# EAGLE design mt15_n (EAGLE 6.6.0)
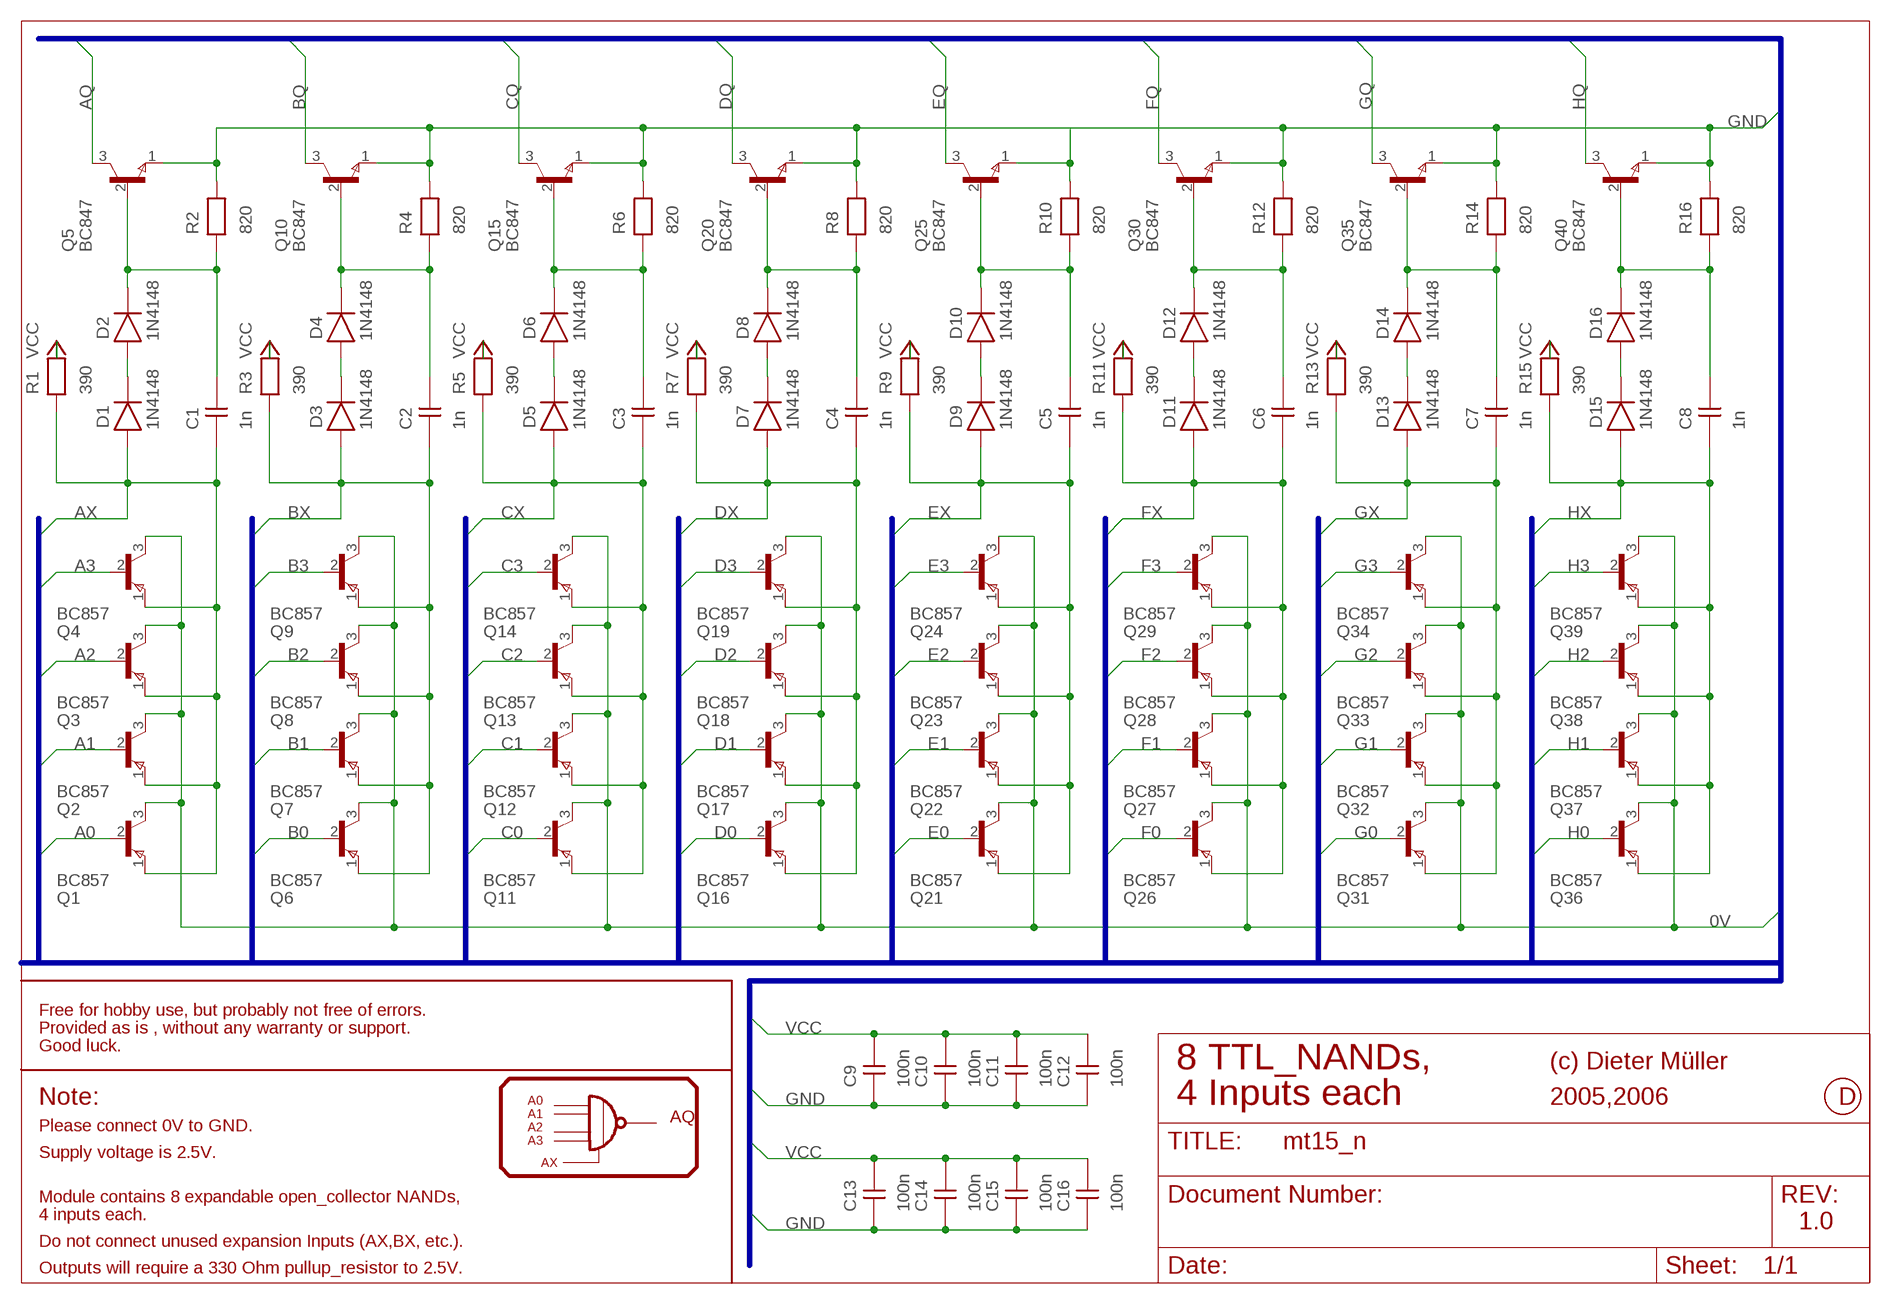
[diagram p0: schematic, sheet 1]

## Parts
C1  1n  CAPNP-5@2  [0204]
C2  1n  CAPNP-5@2  [0204]
C3  1n  CAPNP-5@2  [0204]
C4  1n  CAPNP-5@2  [0204]
C5  1n  CAPNP-5@2  [0204]
C6  1n  CAPNP-5@2  [0204]
C7  1n  CAPNP-5@2  [0204]
C8  1n  CAPNP-5@2  [0204]
C9  100n  CAPNP-5@2  [0204]
C10  100n  CAPNP-5@2  [0204]
C11  100n  CAPNP-5@2  [0204]
C12  100n  CAPNP-5@2  [0204]
C13  100n  CAPNP-5@2  [0204]
C14  100n  CAPNP-5@2  [0204]
C15  100n  CAPNP-5@2  [0204]
C16  100n  CAPNP-5@2  [0204]
D1  1N4148  DIODE-7,5@2  [0204D]
D2  1N4148  DIODE-7,5@2  [0204D]
D3  1N4148  DIODE-7,5@2  [0204D]
D4  1N4148  DIODE-7,5@2  [0204D]
D5  1N4148  DIODE-7,5@2  [0204D]
D6  1N4148  DIODE-7,5@2  [0204D]
D7  1N4148  DIODE-7,5@2  [0204D]
D8  1N4148  DIODE-7,5@2  [0204D]
D9  1N4148  DIODE-7,5@2  [0204D]
D10  1N4148  DIODE-7,5@2  [0204D]
D11  1N4148  DIODE-7,5@2  [0204D]
D12  1N4148  DIODE-7,5@2  [0204D]
D13  1N4148  DIODE-7,5@2  [0204D]
D14  1N4148  DIODE-7,5@2  [0204D]
D15  1N4148  DIODE-7,5@2  [0204D]
D16  1N4148  DIODE-7,5@2  [0204D]
Q1  BC857  BC557@2  [SOT-23]
Q2  BC857  BC557@2  [SOT-23]
Q3  BC857  BC557@2  [SOT-23]
Q4  BC857  BC557@2  [SOT-23]
Q5  BC847  BC547@2  [SOT-23]
Q6  BC857  BC557@2  [SOT-23]
Q7  BC857  BC557@2  [SOT-23]
Q8  BC857  BC557@2  [SOT-23]
Q9  BC857  BC557@2  [SOT-23]
Q10  BC847  BC547@2  [SOT-23]
Q11  BC857  BC557@2  [SOT-23]
Q12  BC857  BC557@2  [SOT-23]
Q13  BC857  BC557@2  [SOT-23]
Q14  BC857  BC557@2  [SOT-23]
Q15  BC847  BC547@2  [SOT-23]
Q16  BC857  BC557@2  [SOT-23]
Q17  BC857  BC557@2  [SOT-23]
Q18  BC857  BC557@2  [SOT-23]
Q19  BC857  BC557@2  [SOT-23]
Q20  BC847  BC547@2  [SOT-23]
Q21  BC857  BC557@2  [SOT-23]
Q22  BC857  BC557@2  [SOT-23]
Q23  BC857  BC557@2  [SOT-23]
Q24  BC857  BC557@2  [SOT-23]
Q25  BC847  BC547@2  [SOT-23]
Q26  BC857  BC557@2  [SOT-23]
Q27  BC857  BC557@2  [SOT-23]
Q28  BC857  BC557@2  [SOT-23]
Q29  BC857  BC557@2  [SOT-23]
Q30  BC847  BC547@2  [SOT-23]
Q31  BC857  BC557@2  [SOT-23]
Q32  BC857  BC557@2  [SOT-23]
Q33  BC857  BC557@2  [SOT-23]
Q34  BC857  BC557@2  [SOT-23]
Q35  BC847  BC547@2  [SOT-23]
Q36  BC857  BC557@2  [SOT-23]
Q37  BC857  BC557@2  [SOT-23]
Q38  BC857  BC557@2  [SOT-23]
Q39  BC857  BC557@2  [SOT-23]
Q40  BC847  BC547@2  [SOT-23]
R1  390  RESEU-7,5@2  [0204]
R2  820  RESEU-7,5@2  [0204]
R3  390  RESEU-7,5@2  [0204]
R4  820  RESEU-7,5@2  [0204]
R5  390  RESEU-7,5@2  [0204]
R6  820  RESEU-7,5@2  [0204]
R7  390  RESEU-7,5@2  [0204]
R8  820  RESEU-7,5@2  [0204]
R9  390  RESEU-7,5@2  [0204]
R10  820  RESEU-7,5@2  [0204]
R11  390  RESEU-7,5@2  [0204]
R12  820  RESEU-7,5@2  [0204]
R13  390  RESEU-7,5@2  [0204]
R14  820  RESEU-7,5@2  [0204]
R15  390  RESEU-7,5@2  [0204]
R16  820  RESEU-7,5@2  [0204]

## Nets
0V: Q1.3(C) Q2.3(C) Q3.3(C) Q4.3(C) Q6.3(C) Q7.3(C) Q8.3(C) Q9.3(C) Q11.3(C) Q12.3(C) Q13.3(C) Q14.3(C) Q16.3(C) Q17.3(C) Q18.3(C) Q19.3(C) Q21.3(C) Q22.3(C) Q23.3(C) Q24.3(C) Q26.3(C) Q27.3(C) Q28.3(C) Q29.3(C) Q31.3(C) Q32.3(C) Q33.3(C) Q34.3(C) Q36.3(C) Q37.3(C) Q38.3(C) Q39.3(C)
A0: Q1.2(B)
A1: Q2.2(B)
A2: Q3.2(B)
A3: Q4.2(B)
AQ: Q5.3(C)
AX: C1.1 D1.1(A) Q1.1(E) Q2.1(E) Q3.1(E) Q4.1(E) R1.1
B0: Q6.2(B)
B1: Q7.2(B)
B2: Q8.2(B)
B3: Q9.2(B)
BQ: Q10.3(C)
BX: C2.1 D3.1(A) Q6.1(E) Q7.1(E) Q8.1(E) Q9.1(E) R3.1
C0: Q11.2(B)
C1: Q12.2(B)
C2: Q13.2(B)
C3: Q14.2(B)
CQ: Q15.3(C)
CX: C3.1 D5.1(A) Q11.1(E) Q12.1(E) Q13.1(E) Q14.1(E) R5.1
D0: Q16.2(B)
D1: Q17.2(B)
D2: Q18.2(B)
D3: Q19.2(B)
DQ: Q20.3(C)
DX: C4.1 D7.1(A) Q16.1(E) Q17.1(E) Q18.1(E) Q19.1(E) R7.1
E0: Q21.2(B)
E1: Q22.2(B)
E2: Q23.2(B)
E3: Q24.2(B)
EQ: Q25.3(C)
EX: C5.1 D9.1(A) Q21.1(E) Q22.1(E) Q23.1(E) Q24.1(E) R9.1
F0: Q26.2(B)
F1: Q27.2(B)
F2: Q28.2(B)
F3: Q29.2(B)
FQ: Q30.3(C)
FX: C6.1 D11.1(A) Q26.1(E) Q27.1(E) Q28.1(E) Q29.1(E) R11.1
G0: Q31.2(B)
G1: Q32.2(B)
G2: Q33.2(B)
G3: Q34.2(B)
GND: C9.1 C10.1 C11.1 C12.1 C13.1 C14.1 C15.1 C16.1 Q5.1(E) Q10.1(E) Q15.1(E) Q20.1(E) Q25.1(E) Q30.1(E) Q35.1(E) Q40.1(E) R2.2 R4.2 R6.2 R8.2 R10.2 R12.2 R14.2 R16.2
GQ: Q35.3(C)
GX: C7.1 D13.1(A) Q31.1(E) Q32.1(E) Q33.1(E) Q34.1(E) R13.1
H0: Q36.2(B)
H1: Q37.2(B)
H2: Q38.2(B)
H3: Q39.2(B)
HQ: Q40.3(C)
HX: C8.1 D15.1(A) Q36.1(E) Q37.1(E) Q38.1(E) Q39.1(E) R15.1
N$2: D1.2(K) D2.1(A)
N$3: C1.2 D2.2(K) Q5.2(B) R2.1
N$6: D3.2(K) D4.1(A)
N$7: C2.2 D4.2(K) Q10.2(B) R4.1
N$11: D5.2(K) D6.1(A)
N$12: C3.2 D6.2(K) Q15.2(B) R6.1
N$16: D7.2(K) D8.1(A)
N$17: C4.2 D8.2(K) Q20.2(B) R8.1
N$21: D9.2(K) D10.1(A)
N$22: C5.2 D10.2(K) Q25.2(B) R10.1
N$26: D11.2(K) D12.1(A)
N$27: C6.2 D12.2(K) Q30.2(B) R12.1
N$31: D13.2(K) D14.1(A)
N$32: C7.2 D14.2(K) Q35.2(B) R14.1
N$36: D15.2(K) D16.1(A)
N$37: C8.2 D16.2(K) Q40.2(B) R16.1
VCC: C9.2 C10.2 C11.2 C12.2 C13.2 C14.2 C15.2 C16.2 R1.2 R3.2 R5.2 R7.2 R9.2 R11.2 R13.2 R15.2

## Buses
B$1

## Notes on the sheet
- Free for hobby use, but probably not free of errors.
- Provided as is , without any warranty or support.
- Good luck.
- 8 TTL_NANDs, | (c) Dieter Müller
- Note: | A0 | 4 Inputs each | 2005,2006 | D
- A1
- AQ
- Please connect 0V to GND. | A2
- A3
- Supply voltage is 2.5V.
- AX
- Module contains 8 expandable open_collector NANDs,
- 4 inputs each.
- 1.0
- Do not connect unused expansion Inputs (AX,BX, etc.).
- Zehn kleine Bastler fein, die löten Teile ein.
- Doch plötzlich gab's nur SMD, da waren's nur noch neun.
- Neun kleine Bastler fein, viel Einsamkeit verbracht.
- Und einer hat geheiratet, da waren's nur noch acht.
- Acht kleine Bastler fein, und wo ist DOS geblieben ?
- Seit es nur bunte Fenster gab, da waren's nur noch sieben.
- Sieben kleine Bastler fein, und Schaltungen komplex.
- Dabei ist einer abgedreht, da waren's nur noch sechs.
- Sechs kleine Bastler fein, verdrehten sich die Rümpfe.
- Die Bandscheiben verhakten sich, da waren's nur noch Fünfe.
- Fünf kleine Bastler fein, das Internet war hier.
- Sie trafen falsche Freundlichkeit, da waren's nur noch vier.
- Vier kleine Bastler fein, verkabeln allerlei.
- Und einer hat nicht aufgepasst, da waren's nur noch drei.
- Drei kleine Bastler fein, bei HF gleich dabei.
- Outputs will require a 330 Ohm pullup_resistor to 2.5V.
- Doch einen krallte sich die Post, da waren's nur noch zwei.
- Zwei kleine Bastler fein, geärgert wie sonst keiner.
- Den einen traf der Herzinfarkt, und übrig bleibt noch einer.
- Ein kleiner Bastler fein, das Studium vollbracht,
- hat seit er auf der Arbeit baut, zuhaus' nichts mehr gemacht.
- Ein klein, zwei klein, drei klein vier klein, fünf klein Bastler fein.
- Sechs klein, sieben klein, acht klein, neun klein, zehn klein Bastler fein.
- Denn wer sich Elektronik baut, bleibt öfters einmal liegen.
- Solange es noch Spass dir macht, lass dich nicht unterkriegen.
- Auch du hast keine Chance:
- Zehn kleine Bastler fein...

## Library data of the parts
C1-C16 = DISCRETE:CAPNP-5@2
D1-D16 = DISCRETE:DIODE-7,5@2
Q1-Q4 Q6-Q9 Q11-Q14 Q16-Q19 Q21-Q24 Q26-Q29 Q31-Q34 Q36-Q39 = PNP:BC557@2
Q5 Q10 Q15 Q20 Q25 Q30 Q35 Q40 = NPN:BC547@2
R1-R16 = DISCRETE:RESEU-7,5@2

## Board
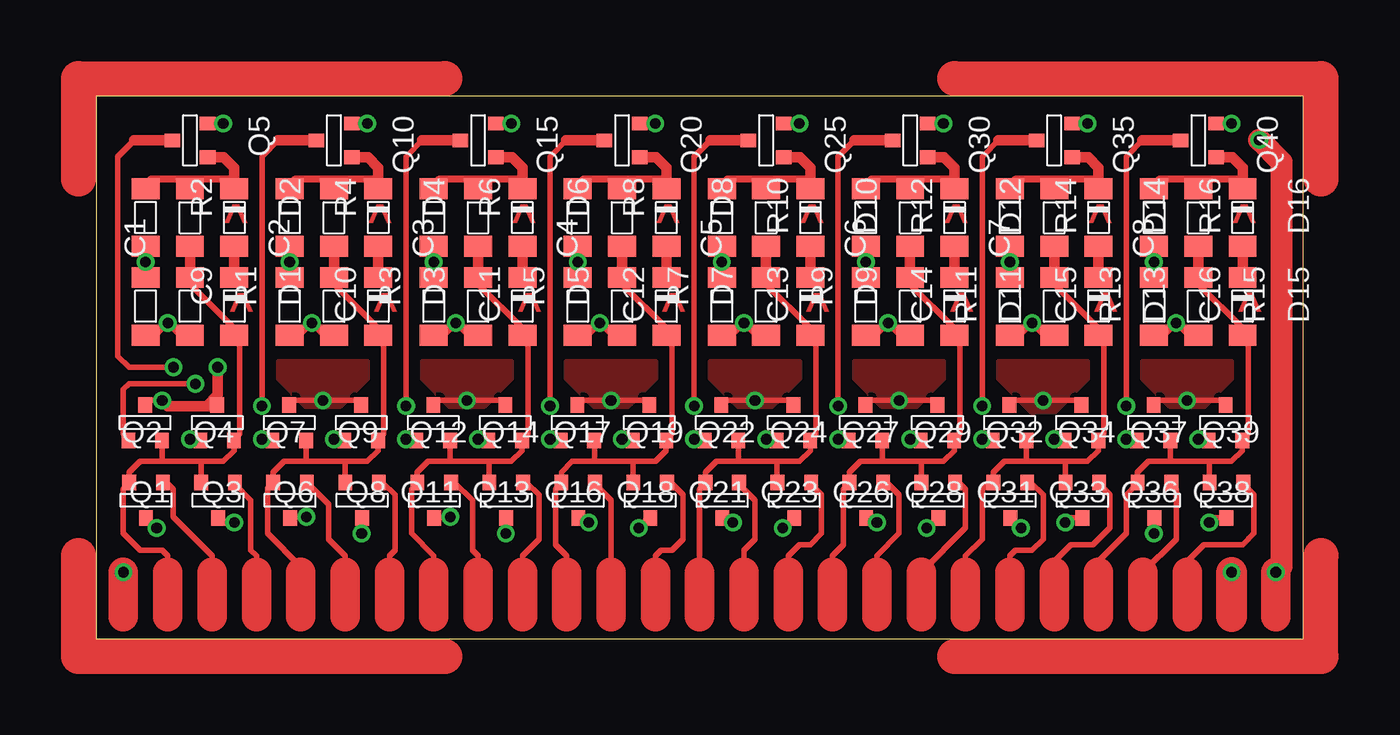
[diagram p1: board, top side]
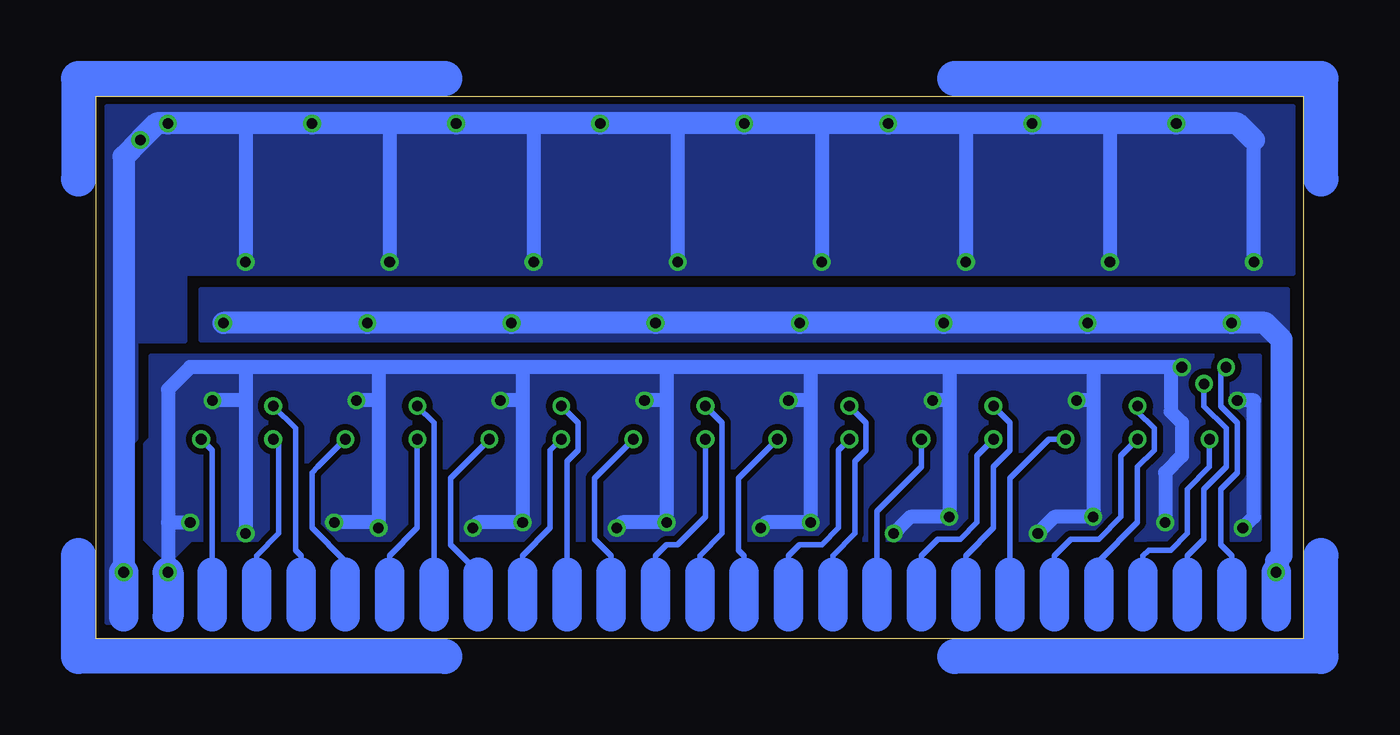
[diagram p2: board, bottom side, seen from below]

Size 69.2 x 31.09 mm. Coordinates in mm from the lower left corner, seen from the top.
Outline: 69.2,0 69.2,31.09 0,31.09 0,0 69.2,0
Copper layers (1*16): Top 0.035mm / dielectric 1.5mm / Bottom 0.035mm
Design rules "default *": minimum track width 10mil, minimum drill 0.6mm, track to track 8mil, track to pad 8mil, pad to pad 8mil, via to via 8mil, smd to smd 8mil, copper to edge 0mil, drill to drill 8mil, minimum pad ring 10mil, minimum via ring 8mil, stop-mask expansion 4mil, vias tented up to drill 0mil, thermal gap 10mil

### Footprints (pad centres in the part's own frame; a part is rotated, then mirrored left to right if it is on the bottom)
0204 = smd 1.194 x 1.6: 1 -1.651,0; 2 1.651,0
0204D = smd 1.194 x 1.6: 1 1.651,0; 2 -1.651,0
SOT-23 = smd 0.787 x 0.889: 1 -0.94,1.016; 2 0.991,1.016; 3 0.025,-1.016

### Placement (x,y rotation side)
C1  5.38,24.13 90 top
C2  13.64,24.13 90 top
C3  21.89,24.13 90 top
C4  30.15,24.13 90 top
C5  38.4,24.13 90 top
C6  46.66,24.13 90 top
C7  54.91,24.13 90 top
C8  63.17,24.13 90 top
C9  2.84,19.05 270 top
C10  11.1,19.05 270 top
C11  19.36,19.05 270 top
C12  27.61,19.05 270 top
C13  35.86,19.05 270 top
C14  44.12,19.05 270 top
C15  52.38,19.05 270 top
C16  60.63,19.05 270 top
D1  7.92,19.05 270 top
D2  7.92,24.13 270 top
D3  16.18,19.05 270 top
D4  16.18,24.13 270 top
D5  24.44,19.05 270 top
D6  24.44,24.13 270 top
D7  32.69,19.05 270 top
D8  32.69,24.13 270 top
D9  40.95,19.05 270 top
D10  40.95,24.13 270 top
D11  49.2,19.05 270 top
D12  49.2,24.13 270 top
D13  57.45,19.05 270 top
D14  57.45,24.13 270 top
D15  65.71,19.05 270 top
D16  65.71,24.13 270 top
Q1  2.84,12.38 180 top
Q2  2.84,7.94 0 top
Q3  6.97,12.38 180 top
Q4  6.97,7.94 0 top
Q5  5.38,28.57 270 top
Q6  11.1,12.38 180 top
Q7  11.1,7.94 0 top
Q8  15.23,12.38 180 top
Q9  15.23,7.94 0 top
Q10  13.64,28.57 270 top
Q11  19.36,12.38 180 top
Q12  19.36,7.94 0 top
Q13  23.48,12.38 180 top
Q14  23.48,7.94 0 top
Q15  21.89,28.57 270 top
Q16  27.61,12.38 180 top
Q17  27.61,7.94 0 top
Q18  31.74,12.38 180 top
Q19  31.74,7.94 0 top
Q20  30.15,28.57 270 top
Q21  35.86,12.38 180 top
Q22  35.86,7.94 0 top
Q23  39.99,12.38 180 top
Q24  39.99,7.94 0 top
Q25  38.4,28.57 270 top
Q26  44.12,12.38 180 top
Q27  44.12,7.94 0 top
Q28  48.25,12.38 180 top
Q29  48.25,7.94 0 top
Q30  46.66,28.57 270 top
Q31  52.38,12.38 180 top
Q32  52.38,7.94 0 top
Q33  56.5,12.38 180 top
Q34  56.5,7.94 0 top
Q35  54.91,28.57 270 top
Q36  60.63,12.38 180 top
Q37  60.63,7.94 0 top
Q38  64.76,12.38 180 top
Q39  64.76,7.94 0 top
Q40  63.17,28.57 270 top
R1  5.38,19.05 270 top
R2  2.84,24.13 270 top
R3  13.64,19.05 270 top
R4  11.1,24.13 270 top
R5  21.89,19.05 270 top
R6  19.36,24.13 270 top
R7  30.15,19.05 270 top
R8  27.61,24.13 270 top
R9  38.4,19.05 270 top
R10  35.86,24.13 270 top
R11  46.66,19.05 270 top
R12  44.12,24.13 270 top
R13  54.91,19.05 270 top
R14  52.38,24.13 270 top
R15  63.17,19.05 270 top
R16  60.63,24.13 270 top

### Tracks (layer width: path | path; a pad name or v marks a point on that pad's centre or on a via)
0V  (via drill 0.61 pad 1.02)
  Top 0.305: Q2.3 2.91,6.92 v3.48,6.35 | Q7.3 11.16,6.92 11.23,6.99 v12.05,6.99 | Q9.3 15.29,6.92 15.23,6.86 v15.23,6.03 | Q4.3 7.04,6.92 6.97,6.86 7.1,6.86 7.29,6.67 v7.93,6.67 | 23.55,6.92 Q14.3 23.48,6.9 v23.48,6.03 | 40.06,6.92 Q24.3 39.93,6.92 v39.36,6.35 | 48.31,6.92 Q29.3 48.18,6.92 v47.61,6.35 | 64.82,6.92 Q39.3 64.06,6.92 v63.81,6.67 | 56.57,6.92 Q34.3 55.8,6.92 v55.55,6.67 | Q19.3 31.67,6.92 v31.1,6.35 | Q1.3 2.91,13.4 3.16,13.65 v3.8,13.65 | Q6.3 11.16,13.4 11.42,13.65 v13.01,13.65 14.91,13.65 15.16,13.4 Q8.3 | Q11.3 19.42,13.4 19.67,13.65 v21.26,13.65 23.16,13.65 23.42,13.4 Q13.3 | Q16.3 27.67,13.4 27.93,13.65 v29.51,13.65 31.42,13.65 31.67,13.4 Q18.3 | Q21.3 35.93,13.4 36.18,13.65 v37.77,13.65 39.68,13.65 39.93,13.4 Q23.3 | Q26.3 44.18,13.4 44.44,13.65 v46.03,13.65 47.93,13.65 48.18,13.4 Q28.3 | Q31.3 52.44,13.4 52.69,13.65 v54.28,13.65 56.18,13.65 56.44,13.4 Q33.3 | Q36.3 60.69,13.4 60.95,13.65 v62.53,13.65 64.44,13.65 64.69,13.4 Q38.3 | Q12.3 20.24,6.92 v20.31,6.99 | Q17.3 27.99,6.92 v28.25,6.67 | Q22.3 36.25,6.92 v36.5,6.67 | Q27.3 44.5,6.92 v44.75,6.67 | Q32.3 52.44,6.92 v53.01,6.35 | Q37.3 60.66,6.06 v60.63,6.03
  Top 0.61: v3.8,13.65 4.12,13.34 6.34,13.34 | Q3.3 6.88,13.34 6.34,13.34 | 6.34,13.34 6.97,13.97 v6.97,15.56
  Top 1.778: v65.08,3.81 65.08,1.27
  Bottom 0.813: v3.48,6.35 2.84,6.99 2.84,13.65 v3.8,13.65 | v7.93,6.67 7.93,9.53 6.97,10.48 6.97,12.38 7.61,13.02 7.61,15.56 | v15.23,6.03 14.27,6.99 v12.05,6.99 12.05,13.65 | 12.05,13.65 v13.01,13.65 | 12.05,15.56 12.05,13.65 | 7.61,15.56 12.05,15.56 | v6.97,15.56 7.61,15.56 | 12.05,15.56 20.31,15.56 | 20.31,15.56 28.25,15.56 | 28.25,15.56 36.5,15.56 | 36.5,15.56 44.75,15.56 | 20.31,13.65 v20.31,6.99 22.53,6.99 v23.48,6.03 | 20.31,15.56 20.31,13.65 | 20.31,13.65 v21.26,13.65 | v31.1,6.35 30.78,6.67 v28.25,6.67 28.25,13.65 | 28.25,15.56 28.25,13.65 | 28.25,13.65 v29.51,13.65 | 36.5,13.65 v36.5,6.67 39.04,6.67 v39.36,6.35 | 36.5,15.56 36.5,13.65 | 36.5,13.65 v37.77,13.65 | 44.75,13.65 v44.75,6.67 47.29,6.67 v47.61,6.35 | 44.75,15.56 44.75,13.65 | 44.75,13.65 v46.03,13.65 | 65.08,6.67 65.08,14.29 63.81,15.56 60.63,15.56 | 65.08,6.67 v65.08,3.81 | 44.75,15.56 53.01,15.56 | 53.01,15.56 60.63,15.56 | 53.01,6.67 v53.01,6.35 | 53.01,13.65 53.01,6.67 | 53.01,13.65 v54.28,13.65 | 53.01,15.56 53.01,13.65 | 60.63,13.65 v60.63,6.03 | 60.63,15.56 60.63,13.65 | 60.63,13.65 v62.53,13.65 | 65.08,6.67 v63.81,6.67 | 53.01,6.67 v55.55,6.67
  Bottom 1.778: v65.08,3.81 65.08,1.27
  pour Bottom (isolate 0.356): 65.08,4.45 63.8,5.71 2.53,5.71 2.53,16.19 66.03,16.19 66.03,11.43 66.34,11.11 66.34,5.71
  pour Top (isolate 0.356): 10.46,15.88 15.54,15.88 15.54,14.92 13.96,13.34 12.05,13.34 10.46,14.92
  pour Top (isolate 0.356): 18.72,15.88 18.72,14.92 20.31,13.34 22.21,13.34 23.8,14.92 23.8,15.88
  pour Top (isolate 0.356): 26.98,15.88 32.05,15.88 32.05,14.92 30.47,13.34 28.56,13.34 26.98,14.92
  pour Top (isolate 0.356): 35.23,15.88 35.23,14.92 36.82,13.34 38.72,13.34 40.31,14.92 40.31,15.88
  pour Top (isolate 0.356): 43.48,15.88 48.56,15.88 48.56,14.92 46.98,13.34 45.07,13.34 43.48,14.92
  pour Top (isolate 0.356): 51.74,15.88 56.82,15.88 56.82,14.92 54.91,13.02 53.64,13.02 51.74,14.92
  pour Top (isolate 0.356): 59.99,15.88 65.08,15.88 65.08,14.92 63.49,13.34 61.58,13.34 59.99,14.92
A0  (via drill 0.61 pad 1.02)
  Top 0.305: Q1.2 1.85,11.47 1.57,11.75 1.57,14.29 1.89,14.61 v5.7,14.61
  Bottom 0.305: 6.66,3.81 6.66,4.76 5.7,5.71 5.7,8.57 4.43,9.84 4.43,12.06 5.7,13.34 v5.7,14.61
  Bottom 1.676: 6.66,1.27 6.66,3.81
A1
  Top 0.305: 6.66,3.81 6.66,4.76 4.43,6.99 4.43,8.57 4.05,8.95 Q2.2
  Top 1.676: 6.66,1.27 6.66,3.81
A2  (via drill 0.61 pad 1.02)
  Top 0.305: Q3.2 5.45,11.37 v5.38,11.43
  Bottom 0.305: 9.19,3.81 9.19,4.76 8.88,5.08 7.61,5.08 6.66,6.03 6.66,8.57 5.38,9.84 v5.38,11.43
  Bottom 1.676: 9.19,1.27 9.19,3.81
A3
  Top 0.305: Q4.2 7.96,8.85 8.88,7.94 8.88,5.08 9.19,4.76 9.19,3.81
  Top 1.676: 9.19,1.27 9.19,3.81
AQ  (via drill 0.61 pad 1.02)
  Top 0.305: 2.18,28.55 1.26,27.62 1.26,16.19 1.89,15.56 v4.43,15.56
  Top 0.61: 2.18,28.55 Q5.3
  Bottom 0.305: 4.12,3.81 4.12,4.76 4.75,5.4 4.75,8.57 3.8,9.53 3.8,12.38 4.75,13.34 4.75,15.24 v4.43,15.56
  Bottom 1.676: 4.12,1.27 4.12,3.81
AX
  Top 0.305: R1.1 5.38,20.32 7.93,17.78 D1.1 7.93,17.14 8.24,16.83 8.24,11.75 7.91,11.42 Q3.1 7.91,10.78 7.29,10.16 6.02,10.16 | 4.12,3.81 4.12,4.76 3.8,5.08 2.53,5.08 1.57,6.03 1.57,8.57 1.91,8.9 Q2.1 1.91,9.54 2.53,10.16 3.8,10.16 | 3.8,10.16 6.02,10.16 | Q1.1 3.8,11.35 3.8,10.16 | Q4.1 6.02,8.97 6.02,10.16
  Top 0.61: R1.1 C1.1
  Top 1.676: 4.12,1.27 4.12,3.81
B0  (via drill 0.61 pad 1.02)
  Top 0.305: Q6.2 9.58,11.37 v9.51,11.43
  Bottom 0.305: 14.27,3.81 14.27,4.76 13.32,5.71 11.74,5.71 10.46,6.99 10.46,10.48 v9.51,11.43
  Bottom 1.676: 14.27,1.27 14.27,3.81
B1
  Top 0.305: Q7.2 13.32,7.72 13.32,5.71 14.27,4.76 14.27,3.81
  Top 1.676: 14.27,1.27 14.27,3.81
B2  (via drill 0.61 pad 1.02)
  Top 0.305: Q8.2 13.7,11.37 v13.64,11.43
  Bottom 0.305: 16.82,3.81 16.82,9.21 14.59,11.43 v13.64,11.43
  Bottom 1.676: 16.82,1.27 16.82,3.81
B3
  Top 0.305: Q9.2 16.43,8.95 17.13,8.26 17.13,5.08 16.82,4.76 16.82,3.81
  Top 1.676: 16.82,1.27 16.82,3.81
BQ  (via drill 0.61 pad 1.02)
  Top 0.305: 10.44,28.55 9.51,27.62 v9.51,13.34
  Top 0.61: 10.44,28.55 Q10.3
  Bottom 0.305: 11.74,3.81 11.74,4.45 9.51,6.67 9.51,9.84 8.56,10.79 8.56,12.06 9.51,13.02 v9.51,13.34
  Bottom 1.676: 11.74,1.27 11.74,3.81
BX
  Top 0.305: R3.1 13.64,20.32 16.18,17.78 D3.1 16.18,17.14 16.5,16.83 16.5,11.75 16.17,11.42 Q8.1 16.17,10.78 15.54,10.16 14.27,10.16 | 11.74,3.81 11.74,4.13 9.83,6.03 9.83,8.62 Q7.1 10.16,9.54 10.78,10.16 12.05,10.16 | 12.05,10.16 14.27,10.16 | Q6.1 12.05,11.35 12.05,10.16 | Q9.1 14.27,8.97 14.27,10.16
  Top 0.61: R3.1 C2.1
  Top 1.676: 11.74,1.27 11.74,3.81
C0  (via drill 0.61 pad 1.02)
  Top 0.305: Q11.2 17.83,11.37 v17.77,11.43
  Bottom 0.305: v17.77,11.43 18.72,10.48 18.72,6.67 19.67,5.71 20.94,5.71 21.89,4.76 21.89,3.81
  Bottom 1.676: 21.89,1.27 21.89,3.81
C1
  Top 0.305: Q12.2 20.56,8.95 21.58,7.94 21.58,5.08 21.89,4.76 21.89,3.81
  Top 1.676: 21.89,1.27 21.89,3.81
C2  (via drill 0.61 pad 1.02)
  Top 0.305: Q13.2 21.96,11.37 v21.89,11.43
  Bottom 0.305: 24.44,3.81 24.44,7.3 21.89,9.84 v21.89,11.43
  Bottom 1.676: 24.44,1.27 24.44,3.81
C3
  Top 0.305: Q14.2 24.69,8.95 25.39,8.26 25.39,5.71 24.44,4.76 24.44,3.81
  Top 1.676: 24.44,1.27 24.44,3.81
CQ  (via drill 0.61 pad 1.02)
  Top 0.305: 18.69,28.55 17.77,27.62 v17.77,13.34
  Top 0.61: 18.69,28.55 Q15.3
  Bottom 0.305: 19.35,3.81 19.35,4.76 17.77,6.35 17.77,9.84 16.82,10.79 16.82,12.38 v17.77,13.34
  Bottom 1.676: 19.35,1.27 19.35,3.81
CX
  Top 0.305: R5.1 21.89,20.32 24.44,17.78 D5.1 24.44,17.14 24.75,16.83 24.75,11.75 24.42,11.42 Q13.1 24.42,10.78 23.8,10.16 22.53,10.16 | 20.31,10.16 19.04,10.16 18.42,9.54 Q12.1 18.42,8.9 18.09,8.57 18.09,6.03 19.35,4.76 19.35,3.81 | 20.31,10.16 22.53,10.16 | Q14.1 22.53,8.97 22.53,10.16 | Q11.1 20.31,11.35 20.31,10.16
  Top 0.61: R5.1 C3.1
  Top 1.676: 19.35,1.27 19.35,3.81
D0  (via drill 0.61 pad 1.02)
  Top 0.305: Q16.2 26.09,11.37 v26.02,11.43
  Bottom 0.305: 29.51,3.81 29.51,4.76 28.88,5.4 27.61,5.4 26.66,6.35 26.66,10.79 v26.02,11.43
  Bottom 1.676: 29.51,1.27 29.51,3.81
D1
  Top 0.305: Q17.2 28.6,8.85 29.51,7.94 29.51,3.81
  Top 1.676: 29.51,1.27 29.51,3.81
D2  (via drill 0.61 pad 1.02)
  Top 0.305: Q18.2 30.21,11.37 v30.15,11.43
  Bottom 0.305: 32.06,3.81 32.06,4.76 32.37,5.08 32.37,9.21 v30.15,11.43
  Bottom 1.676: 32.06,1.27 32.06,3.81
D3
  Top 0.305: Q19.2 32.94,8.95 33.64,8.26 33.64,5.71 33.01,5.08 32.37,5.08 32.06,4.76 32.06,3.81
  Top 1.676: 32.06,1.27 32.06,3.81
DQ  (via drill 0.61 pad 1.02)
  Top 0.305: 26.95,28.55 26.02,27.62 v26.02,13.34
  Top 0.61: 26.95,28.55 Q20.3
  Bottom 0.305: 26.98,3.81 26.98,4.76 25.71,6.03 25.71,10.16 25.07,10.79 25.07,12.38 v26.02,13.34
  Bottom 1.676: 26.98,1.27 26.98,3.81
DX
  Top 0.305: 30.15,20.64 30.15,20.32 32.69,17.78 D7.1 32.69,17.14 33.01,16.83 33.01,11.75 32.68,11.42 Q18.1 32.68,10.78 32.06,10.16 30.78,10.16 | 28.56,10.16 27.29,10.16 26.67,9.54 Q17.1 26.67,8.9 26.34,8.57 26.34,5.4 26.98,4.76 26.98,3.81 | Q16.1 28.56,11.35 28.56,10.16 | 28.56,10.16 30.78,10.16 | Q19.1 30.78,8.97 30.78,10.16
  Top 0.61: 30.15,20.64 R7.1 C4.1
  Top 1.676: 26.98,1.27 26.98,3.81
E0  (via drill 0.61 pad 1.02)
  Top 0.305: Q21.2 34.34,11.37 v34.28,11.43
  Bottom 0.305: 37.14,3.81 37.14,4.76 36.5,5.4 35.86,5.4 34.28,6.99 v34.28,11.43
  Bottom 1.676: 37.14,1.27 37.14,3.81
E1
  Top 0.305: Q22.2 36.86,8.85 37.77,7.94 37.77,5.71 37.14,5.08 37.14,3.81
  Top 1.676: 37.14,1.27 37.14,3.81
E2  (via drill 0.61 pad 1.02)
  Top 0.305: Q23.2 38.47,11.37 v38.4,11.43
  Bottom 0.305: 39.68,3.81 39.68,4.76 40.63,5.71 40.63,9.21 v38.4,11.43
  Bottom 1.676: 39.68,1.27 39.68,3.81
E3
  Top 0.305: Q24.2 40.98,8.85 41.58,8.26 41.58,6.03 40.95,5.4 40.31,5.4 39.68,4.76 39.68,3.81
  Top 1.676: 39.68,1.27 39.68,3.81
EQ  (via drill 0.61 pad 1.02)
  Top 0.305: 35.2,28.55 34.28,27.62 v34.28,13.34
  Top 0.61: 35.2,28.55 Q25.3
  Bottom 0.305: 34.6,3.81 34.6,4.76 33.32,6.03 33.32,12.38 v34.28,13.34
  Bottom 1.676: 34.6,1.27 34.6,3.81
EX
  Top 0.305: R9.1 38.4,20.32 40.95,17.78 D9.1 40.95,17.14 41.26,16.83 41.26,11.75 40.93,11.42 Q23.1 40.93,10.78 40.31,10.16 39.04,10.16 | 36.82,10.16 35.55,10.16 34.93,9.54 Q22.1 34.93,8.9 34.6,8.57 34.6,3.81 | 36.82,10.16 39.04,10.16 | Q21.1 36.82,11.35 36.82,10.16 | Q24.1 39.04,8.97 39.04,10.16
  Top 0.61: R9.1 C5.1
  Top 1.676: 34.6,1.27 34.6,3.81
F0  (via drill 0.61 pad 1.02)
  Top 0.305: Q26.2 43.07,11.43 v42.53,11.43
  Bottom 0.305: 44.75,3.81 44.75,4.76 43.17,6.35 43.17,10.79 v42.53,11.43
  Bottom 1.676: 44.75,1.27 44.75,3.81
F1
  Top 0.305: Q27.2 45.33,8.95 46.03,8.26 46.03,6.03 44.75,4.76 44.75,3.81
  Top 1.676: 44.75,1.27 44.75,3.81
F2  (via drill 0.61 pad 1.02)
  Top 0.305: Q28.2 47.19,11.43 v46.66,11.43
  Bottom 0.305: 47.29,3.81 48.88,5.4 48.88,9.21 v46.66,11.43
  Bottom 1.676: 47.29,1.27 47.29,3.81
F3
  Top 0.305: Q29.2 49.45,8.95 49.83,8.57 49.83,6.35 47.29,3.81
  Top 1.676: 47.29,1.27 47.29,3.81
FQ  (via drill 0.61 pad 1.02)
  Top 0.305: 43.46,28.55 42.53,27.62 v42.53,13.34
  Top 0.61: 43.46,28.55 Q30.3
  Bottom 0.305: 42.21,3.81 42.21,10.16 41.58,10.79 41.58,12.38 v42.53,13.34
  Bottom 1.676: 42.21,1.27 42.21,3.81
FX
  Top 0.305: R11.1 46.66,20.32 49.2,17.78 D11.1 49.2,17.14 49.52,16.83 49.52,11.75 49.19,11.42 Q28.1 49.19,10.78 48.57,10.16 47.29,10.16 | 45.07,10.16 43.8,10.16 43.18,9.54 Q27.1 43.18,8.9 42.85,8.57 42.85,5.4 42.21,4.76 42.21,3.81 | 45.07,10.16 47.29,10.16 | Q29.1 47.29,8.97 47.29,10.16 | Q26.1 45.07,11.35 45.07,10.16
  Top 0.61: R11.1 C6.1
  Top 1.676: 42.21,1.27 42.21,3.81
G0  (via drill 0.61 pad 1.02)
  Top 0.305: Q31.2 50.85,11.37 v50.79,11.43
  Bottom 0.305: 52.38,3.81 52.38,4.76 50.79,6.35 v50.79,11.43
  Bottom 1.676: 52.38,1.27 52.38,3.81
G1
  Top 0.305: Q32.2 53.58,8.95 54.28,8.26 54.28,5.71 53.64,5.08 52.69,5.08 52.38,4.76 52.38,3.81
  Top 1.676: 52.38,1.27 52.38,3.81
G2  (via drill 0.61 pad 1.02)
  Top 0.305: Q33.2 54.98,11.37 v54.92,11.43
  Bottom 0.305: 54.92,3.81 54.92,4.45 56.82,6.35 56.82,9.53 56.5,9.84 v54.92,11.43
  Bottom 1.676: 54.92,1.27 54.92,3.81
G3
  Top 0.305: Q34.2 57.49,8.85 58.09,8.26 58.09,6.35 57.14,5.4 55.87,5.4 54.92,4.45 54.92,3.81
  Top 1.676: 54.92,1.27 54.92,3.81
GND  (via drill 0.61 pad 1.02)
  Top 0.305: Q5.1 7.28,29.52 v7.29,29.53 | Q10.1 15.53,29.52 v15.54,29.53 | Q15.1 23.79,29.52 v23.8,29.53 | Q20.1 32.04,29.52 v32.06,29.53 | Q25.1 40.3,29.52 v40.31,29.53 | Q30.1 48.55,29.52 v48.57,29.53 | Q35.1 56.81,29.52 v56.82,29.53 | Q40.1 65.06,29.52 v65.08,29.53
  Top 0.61: C9.1 v2.84,21.59 R2.2 | C10.1 v11.1,21.59 R4.2 | C11.1 v19.35,21.59 R6.2 | C12.1 v27.61,21.59 R8.2 | C13.1 v35.86,21.59 R10.2 | C14.1 v44.12,21.59 R12.2 | 52.38,20.64 C15.1 v52.38,21.59 R14.2 | C16.1 v60.63,21.59 R16.2
  Top 1.27: v67.61,3.81 67.93,4.13 67.93,27.3 v66.66,28.57
  Top 1.676: v67.61,3.81 67.61,1.27
  Bottom 0.813: v2.84,21.59 2.84,28.57 | 11.1,29.53 v11.1,21.59 | 19.35,29.53 v19.35,21.59 | 27.61,29.53 v27.61,21.59 | 35.86,29.53 v35.86,21.59 | 44.12,29.53 v44.12,21.59 | 52.38,29.53 v52.38,21.59 | 60.63,29.53 v60.63,21.59
  Bottom 1.27: v67.61,3.81 67.61,27.62 v66.66,28.57 65.71,29.53 v65.08,29.53 60.63,29.53 v56.82,29.53 52.38,29.53 v48.57,29.53 44.12,29.53 v40.31,29.53 35.86,29.53 v32.06,29.53 27.61,29.53 v23.8,29.53 19.35,29.53 v15.54,29.53 11.1,29.53 v7.29,29.53 3.8,29.53 2.84,28.57
  Bottom 1.676: v67.61,3.81 67.61,1.27
  pour Bottom (isolate 0.356): 0.62,30.48 0.62,20.95 64.12,20.95 64.12,17.08 66.92,17.08 66.92,11.49 67.3,11.11 67.3,0.95 68.57,0.95 68.57,30.48
GQ  (via drill 0.61 pad 1.02)
  Top 0.305: 51.71,28.55 50.79,27.62 v50.79,13.34
  Top 0.61: 51.71,28.55 Q35.3
  Bottom 0.305: 49.83,3.81 49.83,12.38 v50.79,13.34
  Bottom 1.676: 49.83,1.27 49.83,3.81
GX
  Top 0.305: R13.1 54.92,20.32 57.46,17.78 D13.1 57.46,17.14 57.77,16.83 57.77,11.75 57.44,11.42 Q33.1 57.44,10.78 56.82,10.16 55.55,10.16 | 53.33,10.16 52.06,10.16 51.44,9.54 Q32.1 51.17,8.95 50.79,8.57 50.79,5.71 49.83,4.76 49.83,3.81 | 53.33,10.16 55.55,10.16 | Q34.1 55.55,8.97 55.55,10.16 | Q31.1 53.33,11.35 53.33,10.16
  Top 0.61: R13.1 C7.1
  Top 1.676: 49.83,1.27 49.83,3.81
H0  (via drill 0.61 pad 1.02)
  Top 0.305: Q36.2 59.11,11.37 v59.04,11.43
  Bottom 0.305: 60,3.81 60,4.76 58.72,6.03 58.72,11.11 v59.04,11.43
  Bottom 1.676: 60,1.27 60,3.81
H1
  Top 0.305: 60,3.81 61.9,5.71 61.9,8.57 61.62,8.85 Q37.2
  Top 1.676: 60,1.27 60,3.81
H2  (via drill 0.61 pad 1.02)
  Top 0.305: Q38.2 63.23,11.37 v63.17,11.43
  Bottom 0.305: 62.53,3.81 62.53,10.79 v63.17,11.43
  Bottom 1.676: 62.53,1.27 62.53,3.81
H3
  Top 0.305: 62.53,3.81 62.53,4.45 63.49,5.4 65.71,5.4 66.35,6.03 66.35,8.26 65.75,8.85 Q39.2
  Top 1.676: 62.53,1.27 62.53,3.81
HQ  (via drill 0.61 pad 1.02)
  Top 0.305: 59.97,28.55 59.04,27.62 v59.04,13.34
  Top 0.61: 59.97,28.55 Q40.3
  Bottom 0.305: 57.46,3.81 57.46,4.76 57.77,5.08 57.77,12.06 v59.04,13.34
  Bottom 1.676: 57.46,1.27 57.46,3.81
HX
  Top 0.305: R15.1 63.17,20.32 65.71,17.78 D15.1 65.71,17.14 66.03,16.83 66.03,11.75 65.7,11.42 Q38.1 65.7,10.78 65.08,10.16 63.81,10.16 | 61.58,10.16 63.81,10.16 | 61.58,10.16 60.31,10.16 59.69,9.54 Q37.1 59.69,8.9 59.04,8.26 59.04,6.03 57.46,4.45 57.46,3.81 | Q36.1 61.58,11.35 61.58,10.16 | Q39.1 63.81,8.97 63.81,10.16
  Top 0.61: R15.1 C8.1
  Top 1.676: 57.46,1.27 57.46,3.81
N$2
  Top 0.61: D2.1 D1.2
N$3
  Top 0.406: Q5.2 6.38,27.58 | 5.38,26.35 7.93,26.35 D2.2 | R2.1 2.84,26.04 3.16,26.35 5.38,26.35 | 5.38,26.35 C1.2
  Top 0.61: 7.93,26.35 7.93,26.99 7.33,27.58 Q5.2
N$6
  Top 0.61: D4.1 D3.2
N$7
  Top 0.406: Q10.2 14.63,27.58 | 13.64,26.35 16.18,26.35 D4.2 | R4.1 11.1,26.04 11.42,26.35 13.64,26.35 | 13.64,26.35 C2.2
  Top 0.61: 16.18,26.35 16.18,26.99 15.58,27.58 Q10.2
N$11
  Top 0.61: D6.1 D5.2
N$12
  Top 0.406: Q15.2 22.89,27.58 | 21.89,26.35 24.44,26.35 D6.2 | R6.1 19.35,26.04 19.67,26.35 21.89,26.35 | 21.89,26.35 C3.2
  Top 0.61: 24.44,26.35 24.44,26.99 23.84,27.58 Q15.2
N$16
  Top 0.61: D8.1 D7.2
N$17
  Top 0.406: Q20.2 31.14,27.58 | 30.15,26.35 32.69,26.35 D8.2 | R8.1 27.61,26.04 27.93,26.35 30.15,26.35 | 30.15,26.35 C4.2
  Top 0.61: 32.69,26.35 32.69,26.99 32.09,27.58 Q20.2
N$21
  Top 0.61: D10.1 D9.2
N$22
  Top 0.406: Q25.2 39.4,27.58 | R10.1 35.86,26.04 36.18,26.35 38.4,26.35 | 38.4,26.35 40.95,26.35 D10.2 | 38.4,26.35 C5.2
  Top 0.61: 40.95,26.35 40.95,26.99 40.35,27.58 Q25.2
N$26
  Top 0.61: D12.1 D11.2
N$27
  Top 0.406: Q30.2 47.65,27.58 | 46.66,26.35 49.2,26.35 D12.2 | R12.1 44.12,26.04 44.44,26.35 46.66,26.35 | 46.66,26.35 C6.2
  Top 0.61: 49.2,26.35 49.2,26.99 48.6,27.58 Q30.2
N$31
  Top 0.61: D14.1 D13.2
N$32
  Top 0.406: Q35.2 55.91,27.58 | 54.92,26.35 57.46,26.35 D14.2 | 54.92,26.35 C7.2 | R14.1 52.38,26.04 52.69,26.35 54.92,26.35
  Top 0.61: Q35.2 56.86,27.58 57.46,26.99 57.46,26.35
N$36
  Top 0.61: D16.1 D15.2
N$37
  Top 0.406: Q40.2 64.16,27.58 | 63.17,26.35 65.71,26.35 D16.2 | R16.1 60.63,26.04 60.95,26.35 63.17,26.35 | 63.17,26.35 C8.2
  Top 0.61: 65.71,26.35 65.71,26.99 65.11,27.58 Q40.2
S$1
  Top 2: 70.2,4.76 70.2,-1 49.2,-1
S$2
  Top 2: 70.2,26.34 70.2,32.09 49.2,32.09
S$3
  Top 2: -1,4.76 -1,-1 20,-1
S$4
  Top 2: 20,32.09 -1,32.09 -1,26.34
S$5
  Bottom 2: 70.2,4.76 70.2,-1 49.2,-1
S$6
  Bottom 2: 70.2,26.34 70.2,32.09 49.2,32.09
S$7
  Bottom 2: -1,4.76 -1,-1 20,-1
S$8
  Bottom 2: 20,32.09 -1,32.09 -1,26.34
VCC  (via drill 0.61 pad 1.02)
  Top 0.305: R15.2 62.6,17.4 v61.9,18.1 61.2,17.4 C16.2 | R13.2 54.34,17.4 v53.64,18.1 52.95,17.4 C15.2 | C14.2 44.69,17.4 v45.39,18.1 46.09,17.4 R11.2 | R9.2 37.83,17.4 v37.14,18.1 36.44,17.4 C13.2 | C11.2 19.93,17.4 v20.62,18.1 21.32,17.4 R5.2 | C12.2 28.18,17.4 v28.88,18.1 29.58,17.4 R7.2 | C9.2 3.42,17.4 v4.12,18.1 4.81,17.4 R1.2 | C10.2 11.67,17.4 v12.37,18.1 13.07,17.4 R3.2
  Top 1.676: v1.57,3.81 1.57,1.27
  Bottom 1.27: v1.57,3.81 1.57,4.45 1.26,4.76 1.26,17.14 2.21,18.1 v4.12,18.1 v12.37,18.1 v20.62,18.1 v28.88,18.1 v37.14,18.1 v45.39,18.1 v53.64,18.1 v61.9,18.1
  Bottom 1.676: 1.57,1.27 v1.57,3.81
  pour Bottom (isolate 0.356): 0.94,20 63.17,20 63.17,17.14 0.94,17.14

### Text on the board
Top: ^ | ^ | ^ | ^ | ^ | ^ | ^ | ^ | ^ | ^ | ^ | ^ | ^ | ^ | ^ | ^
Document: top | VCC | AX | A1 | A3 | BX | B1 | B3 | CX | C1 | C3 | DX | D1 | D3 | EX | E1 | E3 | FX | F1 | F3 | GX | G1 | G3 | HX | H1 | H3 | 0V | GND | bot | VCC | AQ | A0 | A2 | BQ | B0 | B2 | CQ | C0 | C2 | DQ | D0 | D2 | EQ | E0 | E2 | FQ | F0 | F2 | GQ | G0 | G2 | HQ | H0 | H2 | 0V | GND